# EasyEDA Pro project USB拓展坞.epro

# Schematic Schematic1
Create Date: 2024-02-17; Page Name: P1; Project Name: USB拓展坞; Schematic Name: Schematic1; Update Date: 2024-02-17; Company: 嘉立创EDA; Page Size: A4; Version: V1.0
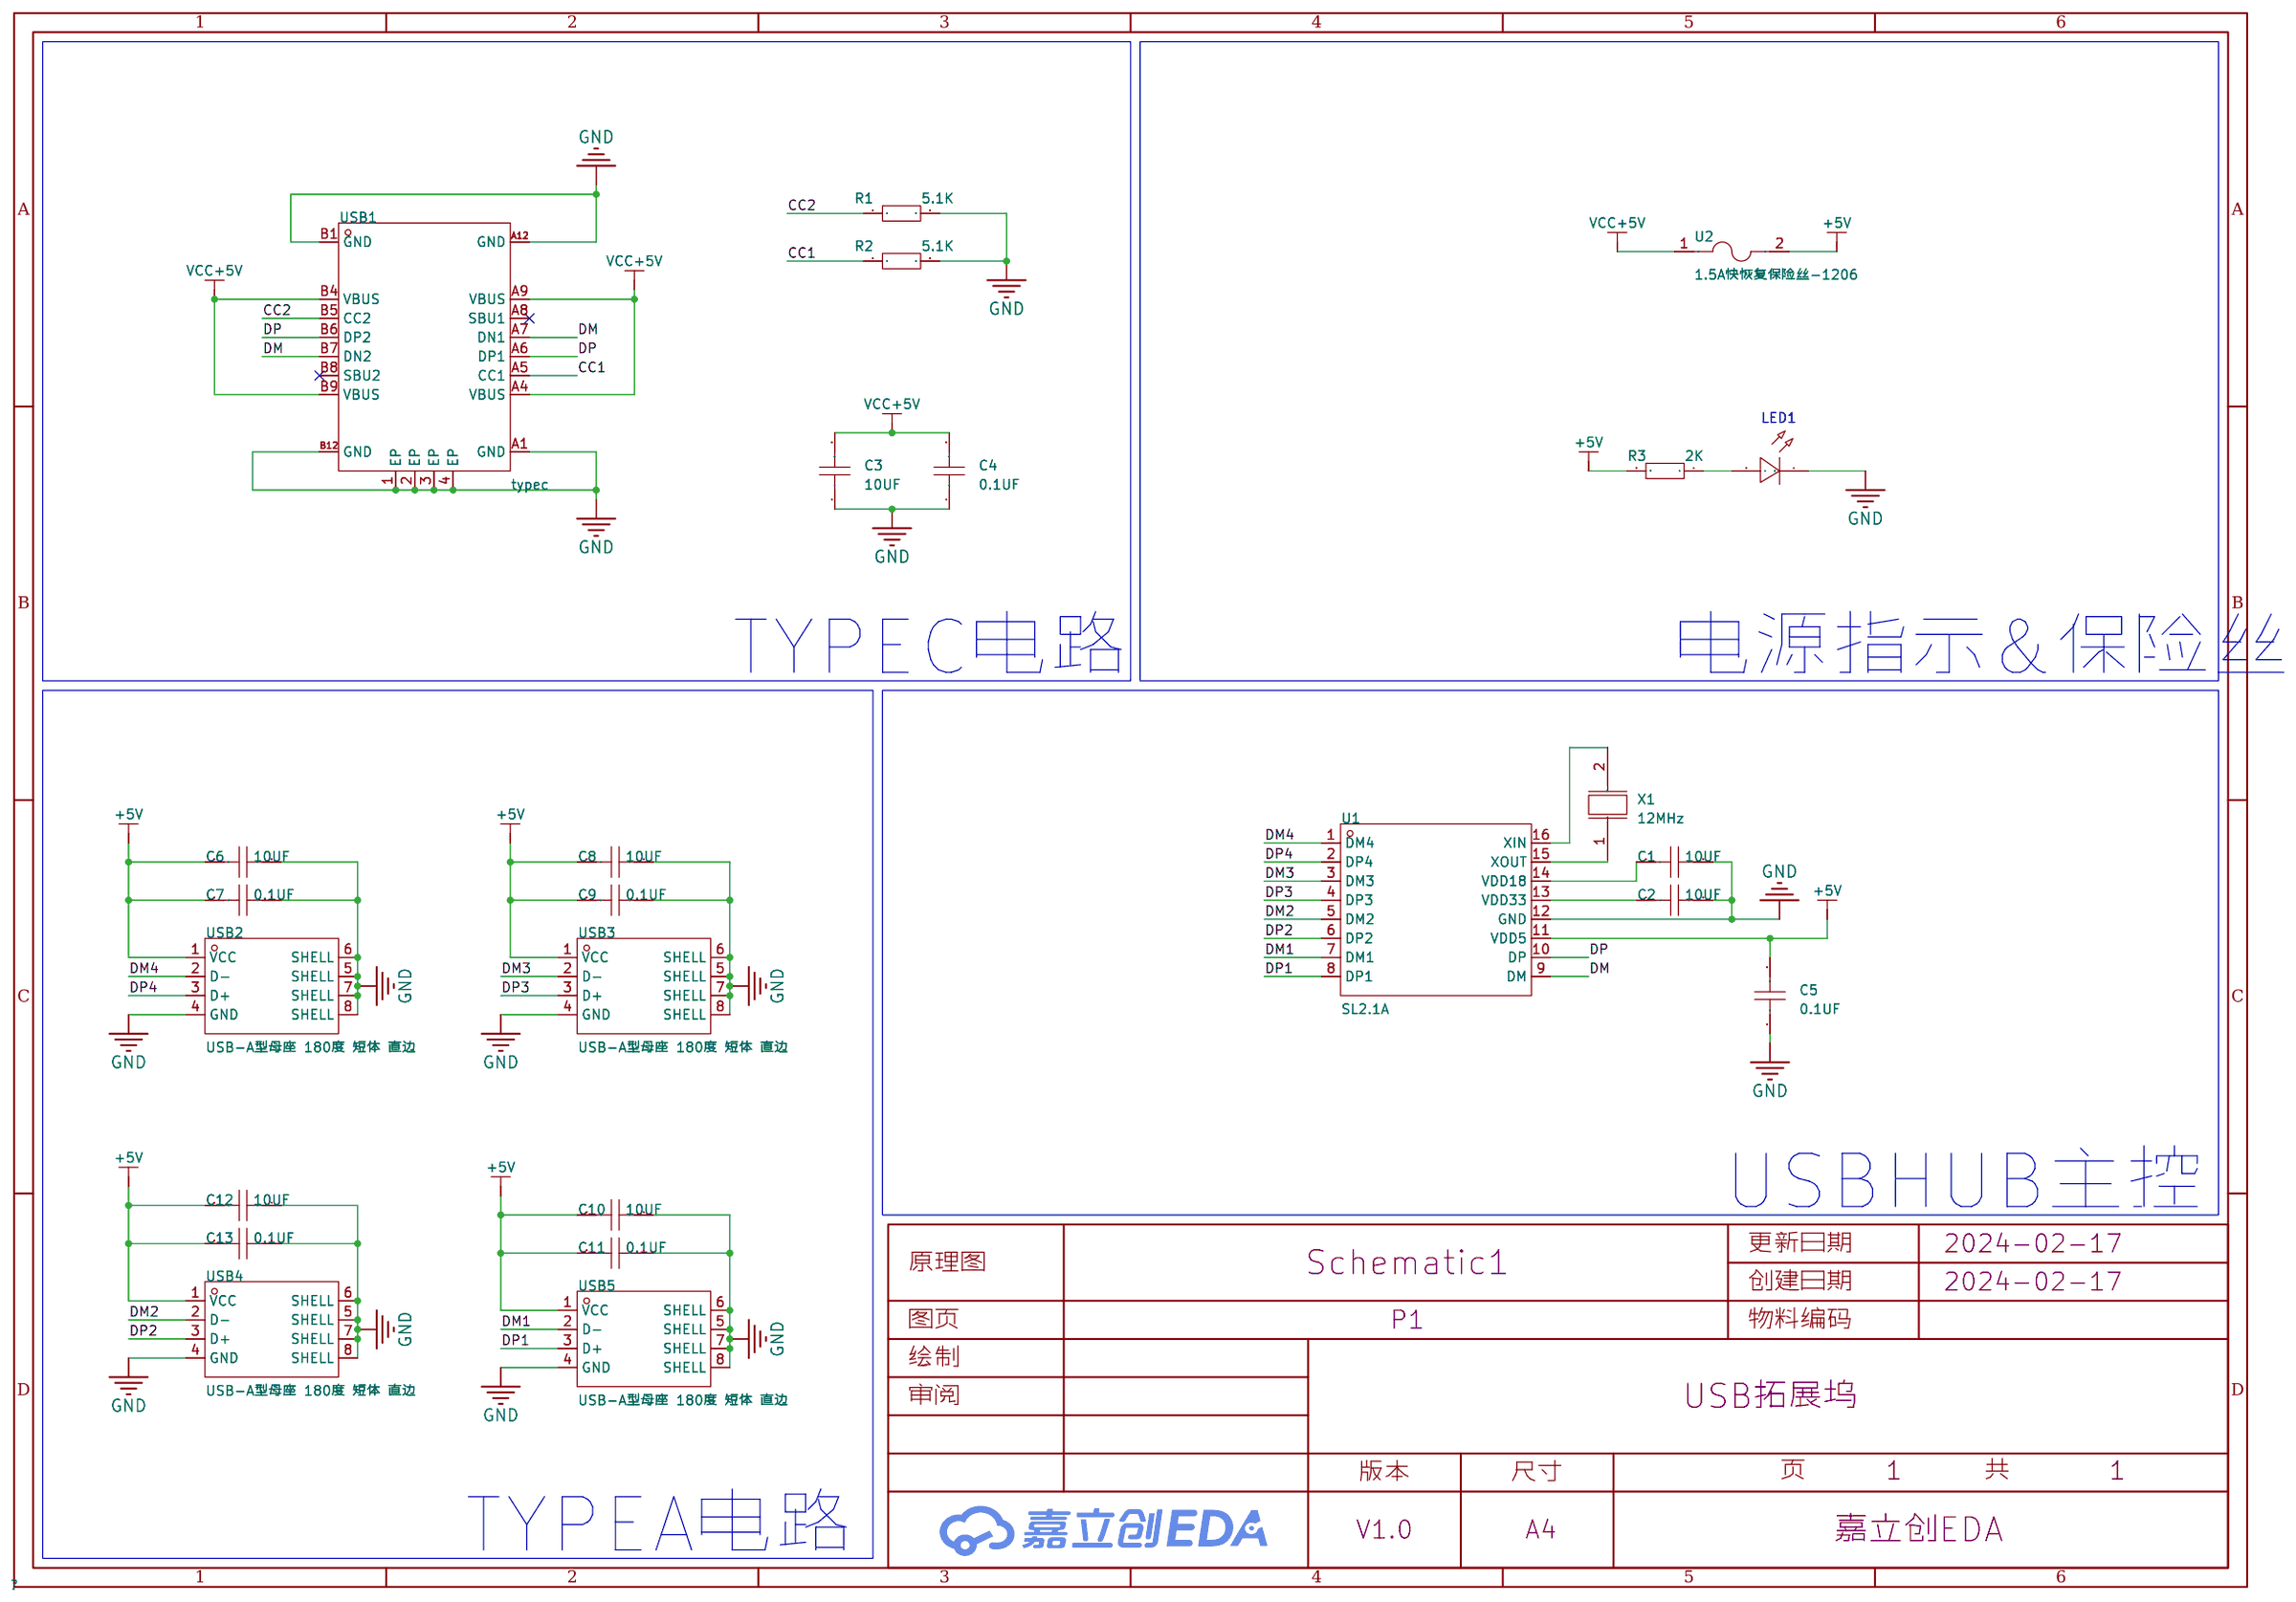
[diagram p0: schematic sheet]

## Parts
C1  10UF  [C0805]
C2  10UF  [C0805]
C3  10UF  [C0805]
C4  0.1UF  [C0805]
C5  0.1UF  [C0805]
C6  10UF  [C0805]
C7  0.1UF  [C0805]
C8  10UF  [C0805]
C9  0.1UF  [C0805]
C10  10UF  [C0805]
C11  0.1UF  [C0805]
C12  10UF  [C0805]
C13  0.1UF  [C0805]
LED1  -  [LED_0805]
R1  5.1K  [R0805]
R2  5.1K  [R0805]
R3  2K  [R0805]
U1  SL2.1A  [SOP-16_L10.0-W3.9-P1.27-LS6.0-BL]
U2  1.5A快恢复保险丝-1206  [F1206]
USB1  typec  [USB-C-SMD_KH-TYPE-C-16P]
USB2  USB-A型母座 180度 短体 直边  [USB-A-SMD_WT_C9900004571]
USB3  USB-A型母座 180度 短体 直边  [USB-A-SMD_WT_C9900004571]
USB4  USB-A型母座 180度 短体 直边  [USB-A-SMD_WT_C9900004571]
USB5  USB-A型母座 180度 短体 直边  [USB-A-SMD_WT_C9900004571]
X1  12MHz  [CRYSTAL-SMD_L5.0-W3.2-1-A]

## Library data of the parts
C1-C13 = CAP_0805: Supplier Footprint: 0805
LED1 = LED_0805-G: Supplier Footprint: 0805
R1-R3 = Res_0805: Supplier Footprint: 0805
U1 = SL2.1A: 应用功能:集线器;接口协议:-;; LCSC Part Name: SL2.1A USB2.0 HUB 控制器集成电路; Supplier Part: C192893; Manufacturer: CoreChips(和芯润德); Supplier Footprint: SOP-16; JLCPCB Part Class: 扩展库; Datasheet: https://atta.szlcsc.com/upload/public/pdf/source/20180522/C192893_624110D24898D57AAC785E3DF98EA862.pdf; Supplier: LCSC; Applications Function: 集线器
U2 = 1.5A快恢复保险丝-1206: Supplier Part: C9900012139; JLCPCB Part Class: 扩展库; Supplier: LCSC
USB1 = typec: Supplier Part: C9900016956; Supplier Footprint: typec 12p; JLCPCB Part Class: 扩展库; Supplier: LCSC
USB2-USB5 = USB-A型母座 180度 短体 直边: Supplier Part: C9900004571; Supplier Footprint: SMD; JLCPCB Part Class: 扩展库; Supplier: LCSC
X1 = 12MHz: Supplier Part: C9900003079; Supplier Footprint: CRYSTAL5032-2P; JLCPCB Part Class: 扩展库; Supplier: LCSC

## Nets
+5V: C5.2 C6.2 C7.2 C8.2 C9.2 C10.2 C11.2 C12.2 C13.2 R3.2 U1.11(VDD5) U2.2 USB2.1(VCC) USB3.1(VCC) USB4.1(VCC) USB5.1(VCC)
GND: C1.2 C2.2 C3.1 C4.1 C5.1 C6.1 C7.1 C8.1 C9.1 C10.1 C11.1 C12.1 C13.1 LED1.1(C) R1.2 R2.2 U1.12(GND) USB1.1(EP) USB1.2(EP) USB1.3(EP) USB1.4(EP) USB1.A1(GND) USB1.A12(GND) USB1.B1(GND) USB1.B12(GND) USB2.4(GND) USB2.5(SHELL) USB2.6(SHELL) USB2.7(SHELL) USB2.8(SHELL) USB3.4(GND) USB3.5(SHELL) USB3.6(SHELL) USB3.7(SHELL) USB3.8(SHELL) USB4.4(GND) USB4.5(SHELL) USB4.6(SHELL) USB4.7(SHELL) USB4.8(SHELL) USB5.4(GND) USB5.5(SHELL) USB5.6(SHELL) USB5.7(SHELL) USB5.8(SHELL)
VCC+5V: C3.2 C4.2 U2.1 USB1.A4(VBUS) USB1.A9(VBUS) USB1.B4(VBUS) USB1.B9(VBUS)
CC1: R2.1 USB1.A5(CC1)
CC2: R1.1 USB1.B5(CC2)
DM: U1.9(DM) USB1.A7(DN1) USB1.B7(DN2)
DM1: U1.7(DM1) USB5.2(D-)
DM2: U1.5(DM2) USB4.2(D-)
DM3: U1.3(DM3) USB3.2(D-)
DM4: U1.1(DM4) USB2.2(D-)
DP: U1.10(DP) USB1.A6(DP1) USB1.B6(DP2)
DP1: U1.8(DP1) USB5.3(D+)
DP2: U1.6(DP2) USB4.3(D+)
DP3: U1.4(DP3) USB3.3(D+)
DP4: U1.2(DP4) USB2.3(D+)
$1N1162: C2.1 U1.13(VDD33)
$1N1165: C1.1 U1.14(VDD18)
$1N1316: U1.15(XOUT) X1.1
$1N1322: U1.16(XIN) X1.2
$1N2735: LED1.2(A) R3.1

Not connected (* = marked no-connect by the designer): USB1 A8(SBU1)* B8(SBU2)*

## Notes on the sheet
- TYPEC电路
- 电源指示&保险丝
- USBHUB主控
- TYPEA电路

# Board PCB1
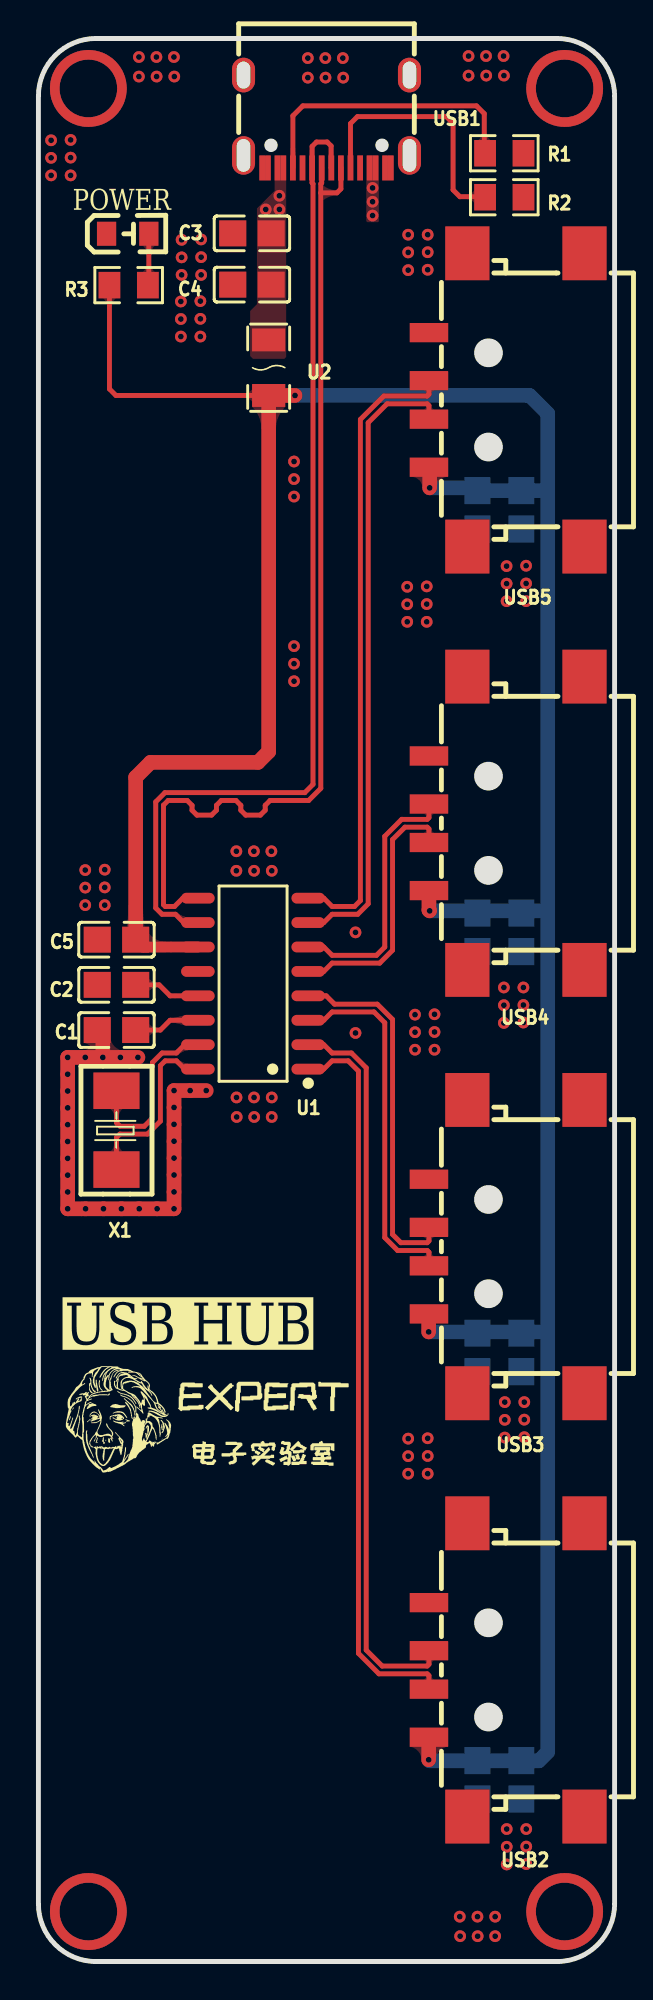
[diagram p1: board, top side]
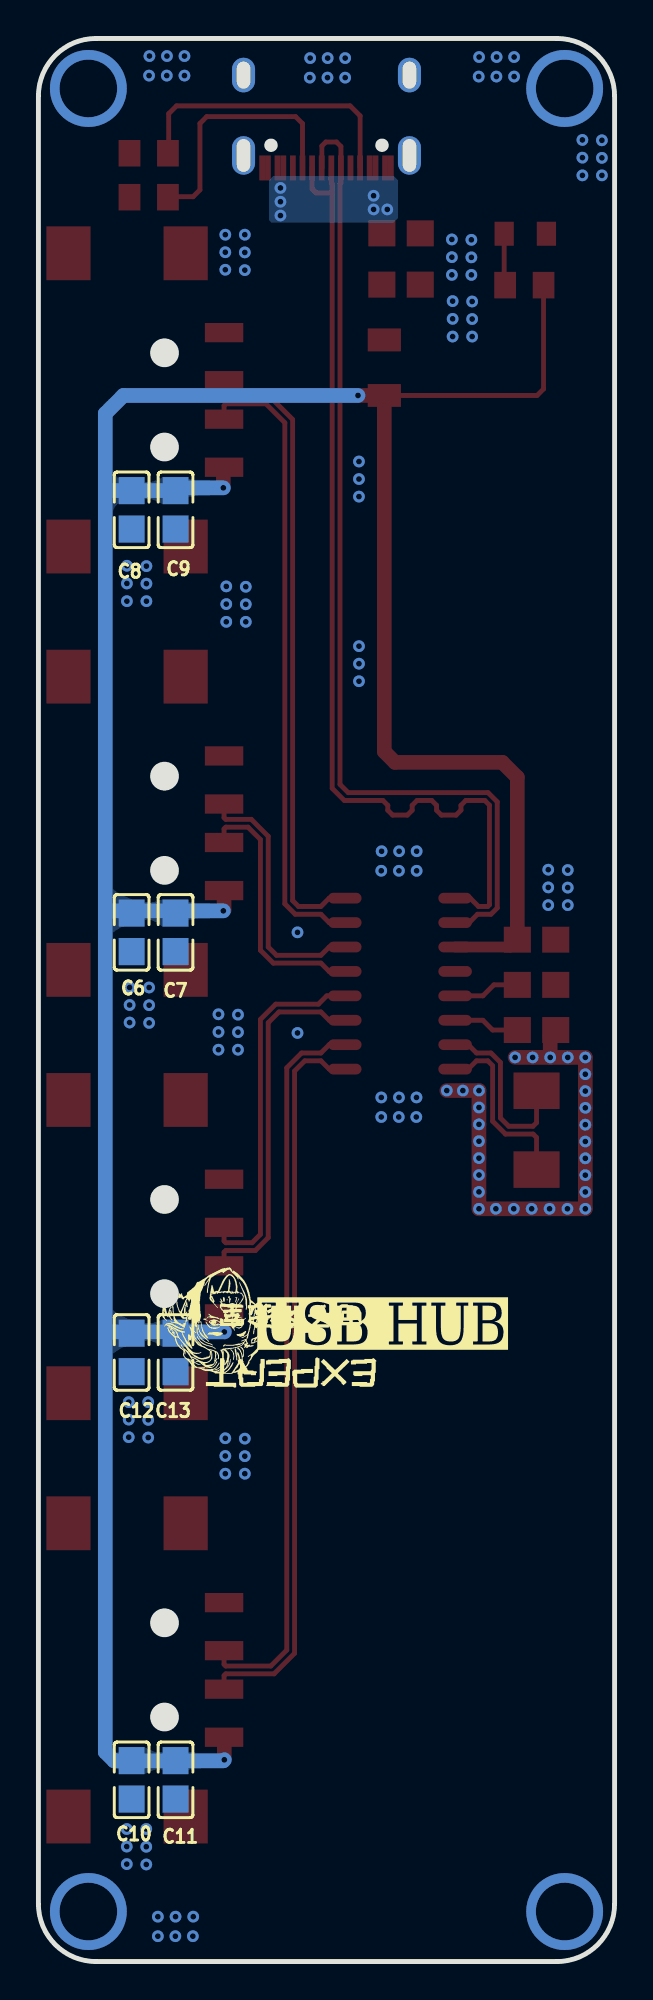
[diagram p2: board, bottom side, seen from below]

Outline 30 x 100 mm; copper layers: Top Layer, Bottom Layer. Coordinates in mm from the lower left corner of the outline.
Outline path: 0,97 0,3 arc(0.88,0.88) 3,0 27,0 arc(29.12,0.88) 30,3 30,97 arc(29.12,99.12) 27,100 3,100 arc(0.88,99.12) 0,97
Stack: Top Layer 0.035mm / Dielectric1 1.51mm FR4 er 4.5 / Bottom Layer 0.035mm

## Design rules (mm)
net DM4: DP4
net DP4: DP4
net DM3: DP3
net DP3: DP3
net DM2: DP2
net DP2: DP2
net DM1: DP1
net DP1: DP1
net $1N1322: DP6
net $1N1316: DP6
net DP: DP5
net DM: DP5
template: 自定义配置
spacing copperThickness1oz (default): track to track 0.102, other pairs 0.152 to 0.3
spacing copperThickness2oz: track to track 0.203, other pairs 0.152 to 0.3
track width copperThickness1oz (default): min 0.127, default 0.254, max 2.54
track width copperThickness2oz: min 0.203, default 0.254, max 2.54
differential pair differentialPair (default): width min 0.127, default 0.254, max 2.54; gap min 0.152, default 0.152
via viaSize (default): diameter min 0.5, default 0.61, max 10; hole min 0.3, default 0.305, max 6.299

## Placement (name value [footprint] x y rotation side)
C1  10UF  [C0805]  4.06 48.44 180 top
C2  10UF  [C0805]  4.06 50.79 180 top
C3  10UF  [C0805]  11.12 89.87 0 top
C4  0.1UF  [C0805]  11.12 87.2 0 top
C5  0.1UF  [C0805]  4.06 53.14 0 top
C6  10UF  [C0805]  25.15 53.52 90 bottom
C7  0.1UF  [C0805]  22.86 53.52 90 bottom
C8  10UF  [C0805]  25.15 75.49 90 bottom
C9  0.1UF  [C0805]  22.86 75.49 90 bottom
C10  10UF  [C0805]  25.15 9.45 90 bottom
C11  0.1UF  [C0805]  22.86 9.45 90 bottom
C12  10UF  [C0805]  25.15 31.67 90 bottom
C13  0.1UF  [C0805]  22.86 31.67 90 bottom
LED1  -  [LED_0805]  4.7 89.84 0 top
R1  5.1K  [R0805]  24.26 94.03 0 top
R2  5.1K  [R0805]  24.26 91.75 0 top
R3  2K  [R0805]  4.7 87.17 180 top
U1  SL2.1A  [SOP-16_L10.0-W3.9-P1.27-LS6.0-BL]  11.18 50.85 90 top
U2  1.5A快恢复保险丝-1206  [F1206]  11.99 82.88 270 top
USB1  typec  [USB-C-SMD_KH-TYPE-C-16P]  15 95.68 180 top
USB2  USB-A型母座 180度 短体 直边  [USB-A-SMD_WT_C9900004571]  24.38 15.16 90 top
USB3  USB-A型母座 180度 短体 直边  [USB-A-SMD_WT_C9900004571]  24.38 37.18 90 top
USB4  USB-A型母座 180度 短体 直边  [USB-A-SMD_WT_C9900004571]  24.38 59.19 90 top
USB5  USB-A型母座 180度 短体 直边  [USB-A-SMD_WT_C9900004571]  24.38 81.2 90 top
X1  12MHz  [CRYSTAL-SMD_L5.0-W3.2-1-A]  4.06 43.23 270 top

## Footprints (pads in the part's own frame, mm; a bottom-side part is the same pattern mirrored in y, then rotated)
C0805
  rect 1.41x1.35 smd: 1(-1,0) 2(1,0)
CRYSTAL-SMD_L5.0-W3.2-1-A
  rect 1.9x2.4 smd: 1(-2.05,0) 2(2.05,0)
F1206
  rect 1.19x1.728 smd: 1(-1.445,0) 2(1.445,0)
LED_0805
  rect 1x1.25 smd: 1(-1.15,0.005) 2(1.05,0.005)
R0805
  rect 1.133x1.377 smd: 1(-1,0) 2(1,0)
SOP-16_L10.0-W3.9-P1.27-LS6.0-BL
  oval 0.56x1.745 smd: 1(-4.445,-2.873) 2(-3.175,-2.873) 3(-1.905,-2.873) 4(-0.635,-2.873) 5(0.635,-2.873) 6(1.905,-2.873) 7(3.175,-2.873) 8(4.445,-2.873) 9(4.445,2.873) 10(3.175,2.873) 11(1.905,2.873) 12(0.635,2.873) 13(-0.635,2.873) 14(-1.905,2.873) 15(-3.175,2.873) 16(-4.445,2.873)
USB-A-SMD_WT_C9900004571
  rect 1x2 smd: 1(-3.5,4.05) 2(-1,4.05) 3(1,4.05) 4(3.5,4.05)
  rect 2.8x2.3 smd: 5(-7.625,2.05) 6(-7.625,-4.05) 7(7.625,-4.05) 8(7.625,2.05)
USB-C-SMD_KH-TYPE-C-16P
  oval 1.2x2 hole 0.7x1.7: 1(-4.32,1.765) 2(4.32,1.765)
  oval 1.2x1.8 hole 0.7x1.4: 3(-4.32,-2.415) 4(4.32,-2.415)
  rect 0.3x1.3 smd: A1(-3.35,2.415) A4(-2.55,2.415) A5(-1.25,2.415) A6(-0.25,2.415) A7(0.25,2.415) A8(1.25,2.415) A9(2.55,2.415) A12(3.35,2.415) B1(3.05,2.415) B4(2.25,2.415) B5(1.75,2.415) B6(0.75,2.415) B7(-0.75,2.415) B8(-1.75,2.415) B9(-2.25,2.415) B12(-3.05,2.415)

## Nets
As in the schematic.

Pads without a net: USB1 A8 B8

## Via types
v1: diameter 4, hole 3, Top Layer to Bottom Layer, 4 vias
v2: diameter 0.61, hole 0.305, Top Layer to Bottom Layer, 156 vias

## Routing (per net, layer and track width the routed paths; a pad name or vN(x,y) marks a point on that pad's centre or on a via; arc(x,y) is an arc through that point)
+5V: length 165.7
  Top Layer w0.254: U2.2 4.04,81.44 3.7,81.77 R3.2
  Top Layer w0.559: U1.11 5.44,52.76 C5.2
  Top Layer w0.762: v2(20.37,54.64) 20.33,54.67 USB4.1 ; v2(20.32,10.49) 20.32,11.65 USB2.1 ; USB5.1 20.37,77.67 v2(20.37,76.63) ; v2(20.32,32.74) 20.32,33.66 USB3.1 ; v2(13.36,81.44) U2.2 11.99,62.92 11.43,62.36 5.84,62.36 5.06,61.58 C5.2
  Bottom Layer w0.762: 26.52,54.64 22.98,54.64 ; 26.52,54.64 26.52,76.54 ; 26.52,54.64 26.52,32.74 ; 22.98,54.64 v2(20.37,54.64) ; 22.98,54.64 C7.2 ; 22.87,10.44 25.16,10.44 ; 22.87,10.44 C11.2 ; 22.87,10.44 20.37,10.44 v2(20.32,10.49) ; 25.16,10.44 26.06,10.44 26.52,10.9 26.52,32.74 ; 25.16,10.44 C10.2 ; 26.52,76.54 26.47,76.49 C8.2 C9.2 22.72,76.63 v2(20.37,76.63) ; 26.52,76.54 26.52,80.49 25.57,81.44 v2(13.36,81.44) ; 26.52,32.74 22.93,32.74 ; 22.93,32.74 C13.2 ; 22.93,32.74 v2(20.32,32.74)
GND: length 26.4
  Top Layer w0.762: v2(3.35,47.02) v2(2.44,47.02) v2(1.52,47.02) v2(1.52,46.14) v2(1.52,45.27) v2(1.52,44.39) v2(1.52,43.52) v2(1.52,42.64) v2(1.52,41.77) v2(1.52,40.89) v2(1.52,40.02) v2(1.52,39.14) v2(2.46,39.14) v2(3.39,39.14) v2(4.32,39.14) v2(5.25,39.14) v2(6.18,39.14) v2(7.06,39.14) v2(7.06,40.02) v2(7.06,40.9) v2(7.06,41.78) v2(7.06,42.66) v2(7.06,43.53) v2(7.06,44.41) v2(7.06,45.29) v2(7.9,45.29) v2(8.74,45.29) ; v2(3.35,47.02) 3.35,48.15 C1.2 ; v2(3.35,47.02) v2(4.27,47.02) v2(5.18,47.02)
  vias: v2(0.66,94.7) v2(0.66,93.79) v2(0.66,92.88) v2(1.68,94.72) v2(1.68,93.8) v2(1.68,92.88) v2(2.44,56.76) v2(2.44,55.84) v2(2.44,54.93) v2(3.45,56.78) v2(3.45,55.86) v2(3.45,54.93) v2(5.23,99.03) v2(5.23,98.02) v2(6.14,99.03) v2(6.15,98.02) v2(7.06,99.03) v2(7.07,98.02) v2(7.42,86.32) v2(7.42,85.41) v2(7.42,84.5) v2(7.46,89.53) v2(7.46,88.62) v2(7.46,87.71) v2(8.43,86.34) v2(8.43,85.42) v2(8.43,84.5) v2(8.47,89.55) v2(8.47,88.63) v2(8.47,87.71) v2(10.31,57.74) v2(10.31,56.72) v2(10.31,44.93) v2(10.32,43.92) v2(11.22,57.74) v2(11.23,56.72) v2(11.23,44.93) v2(11.24,43.92) v2(12.13,57.74) v2(12.15,44.93) v2(12.15,43.92) v2(12.15,56.72) v2(13.31,78) v2(13.31,77.09) v2(13.31,76.18) v2(13.31,68.4) v2(13.31,67.49) v2(13.31,66.58) v2(14.03,98.98) v2(14.03,97.96) v2(14.94,98.98) v2(14.95,97.96) v2(15.85,98.98) v2(15.87,97.96) v2(16.51,53.52) v2(16.51,48.29) v2(19.2,71.49) v2(19.2,70.58) v2(19.2,69.67) v2(19.25,89.8) v2(19.25,88.88) v2(19.25,87.95) v2(19.25,27.19) v2(19.25,26.28) v2(19.25,25.37) v2(19.61,49.24) v2(19.61,48.33) v2(19.61,47.42) v2(20.22,71.51) v2(20.22,70.59) v2(20.22,69.67) v2(20.27,89.8) v2(20.27,88.88) v2(20.27,87.97) v2(20.27,27.21) v2(20.27,26.29) v2(20.27,25.37) v2(20.62,49.26) v2(20.62,48.34) v2(20.62,47.42) v2(21.94,2.33) v2(21.96,1.32) v2(22.4,99.09) v2(22.4,98.07) v2(22.86,2.33) v2(22.87,1.32) v2(23.31,99.09) v2(23.32,98.07) v2(23.78,2.33) v2(23.78,1.32) v2(24.22,99.09) v2(24.24,98.07) v2(24.24,50.65) v2(24.24,49.73) v2(24.24,48.81) v2(24.28,29.09) v2(24.28,28.17) v2(24.28,27.25) v2(24.38,72.56) v2(24.38,71.65) v2(24.38,70.74) v2(24.38,6.89) v2(24.38,5.97) v2(24.38,5.05) v2(25.25,50.65) v2(25.25,49.74) v2(25.25,48.83) v2(25.3,29.09) v2(25.3,28.18) v2(25.3,27.27) v2(25.39,72.58) v2(25.39,71.66) v2(25.39,70.74) v2(25.4,6.89) v2(25.4,5.98) v2(25.4,5.07)
VCC+5V:
  vias: v2(11.84,91.11) v2(12.55,91.82) v2(12.55,91.11) v2(17.4,92.23) v2(17.4,91.51) v2(17.4,90.79)
(no net):
  vias: v1(2.6,97.4) v1(2.6,2.6) v1(27.4,97.4) v1(27.4,2.6)
CC1: length 13.2
  Top Layer w0.254: USB1.A5 16.25,95.57 16.61,95.94 21.23,95.94 21.59,95.58 21.59,92.13 21.95,91.77 23.23,91.77 R2.1
CC2: length 15.1
  Top Layer w0.254: USB1.B5 13.25,95.98 13.77,96.5 22.81,96.5 23.22,96.09 23.22,94.07 R1.1
DM: length 52.1
  Top Layer w0.254: 14.7,91.97 15.54,91.97 15.75,92.18 USB1.B7 ; 14.7,91.97 14.7,61.01 14.07,60.38 12.06,60.38 11.81,60.12 11.81,59.87 11.56,59.61 10.79,59.61 10.54,59.87 10.54,60.12 10.28,60.38 9.52,60.38 9.27,60.12 9.27,59.87 9.01,59.61 8.25,59.61 8,59.87 8,60.12 7.75,60.38 6.76,60.38 6.51,60.13 6.51,54.95 6.6,54.86 7.09,54.86 7.52,55.3 U1.9 ; 14.7,91.97 14.7,92.44 14.75,92.49 USB1.A7
DM1: length 32.9
  Top Layer w0.254: U1.7 14.86,54.03 15.29,54.46 16.63,54.46 17.17,55 17.17,80.02 18.15,81 20.24,81 20.33,80.91 USB5.2
DM2: length 13.5
  Top Layer w0.254: U1.5 14.86,51.49 15.29,51.92 17.77,51.92 18.44,52.59 18.44,58.34 19.08,58.99 20.24,58.99 20.33,58.9 USB4.2
DM3: length 18.9
  Top Layer w0.254: USB3.2 20.33,36.88 20.24,36.97 18.7,36.97 18.03,37.64 18.03,48.82 17.47,49.38 15.29,49.38 14.86,48.95 U1.3
DM4: length 38.1
  Top Layer w0.254: USB2.2 20.33,14.87 20.24,14.96 17.73,14.96 16.66,16.03 16.66,46.3 16.13,46.84 15.29,46.84 14.86,46.41 U1.1
DP: length 52.1
  Top Layer w0.254: U1.10 7.57,54.03 7.14,54.46 6.44,54.46 6.11,54.79 6.11,60.3 6.59,60.78 13.87,60.78 14.3,61.21 14.3,92.44 14.25,92.49 USB1.B6 14.25,94.39 14.48,94.61 15.04,94.61 15.24,94.41 15.24,93.28 USB1.A6
DP1: length 32.9
  Top Layer w0.254: U1.8 14.86,55.3 15.29,54.86 16.46,54.86 16.76,55.17 16.76,80.19 17.98,81.41 20.24,81.41 20.33,81.5 USB5.3
DP2: length 13.5
  Top Layer w0.254: U1.6 14.86,52.76 15.29,52.32 17.6,52.32 18.03,52.76 18.03,58.51 18.91,59.39 20.24,59.39 20.33,59.48 USB4.3
DP3: length 18.9
  Top Layer w0.254: 20.33,38.18 20.33,37.47 20.24,37.38 18.87,37.38 18.44,37.81 18.44,48.99 17.64,49.78 15.42,49.78 14.99,50.22 U1.4
DP4: length 38.1
  Top Layer w0.254: U1.2 14.86,47.68 15.29,47.24 16.3,47.24 17.07,46.47 17.07,16.2 17.9,15.37 20.24,15.37 20.33,15.46 USB2.3
$1N1162: length 3.5
  Top Layer w0.254: C2.1 6.29,50.79 6.86,50.22 U1.13
$1N1165: length 3.4
  Top Layer w0.254: C1.1 6.35,48.44 6.86,48.95 U1.14
$1N1316: length 9.4
  Top Layer w0.254: X1.1 4.06,43.62 4.25,43.43 5.51,43.43 5.94,43.87 5.94,46.75 6.44,47.24 7.19,47.24 7.62,47.68 U1.15
$1N1322: length 9.4
  Top Layer w0.254: U1.16 7.62,46.41 7.19,46.84 6.6,46.84 6.35,46.58 6.35,43.7 5.68,43.03 4.24,43.03 4.06,42.85 X1.2
$1N2735: length 2.7
  Top Layer w0.254: 5.75,89.84 5.75,87.22 R3.1

## Copper pours and planes (outline as drawn; the poured copper is in the pictures)
GND on Top Layer: -6.35,102.54 33.43,102.54 33.43,-3.23 -6.35,-3.23
GND on Bottom Layer: -7.98,105.08 33.63,105.08 33.63,-3.02 -7.98,-3.02
VCC+5V on Top Layer: 11.02,93.92 12.9,93.92 12.9,83.34 11.02,83.34
VCC+5V on Top Layer: 17.07,93.9 17.73,93.9 17.73,90.45 17.07,90.45
VCC+5V on Bottom Layer: 11.28,92.84 17.98,92.84 17.98,90.42 11.28,90.42

Small or netless copper shapes (teardrops, artwork), in the pictures only: 54 on Top Layer, 26 on Bottom Layer

## Text on the board
Bottom Silkscreen Layer: USB HUB
Top Silkscreen Layer: POWER | USB HUB
